# Altium schematic sheet Block_Diagram.SchDoc
size A3; SheetSize: A3; SheetNumber: 3; SheetTotal: 3
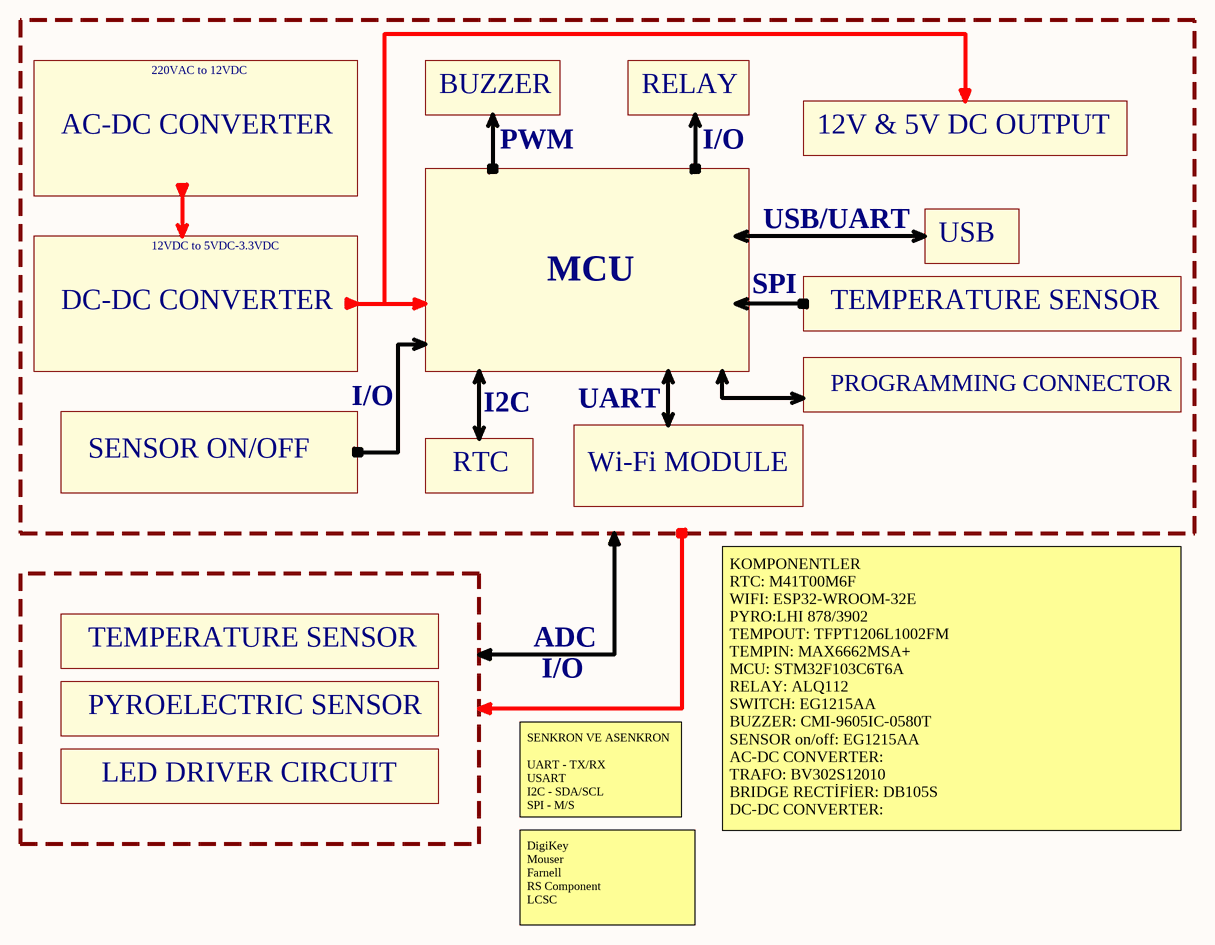
[diagram p0: Block_Diagram.SchDoc]

## Notes on the sheet
- 220VAC to 12VDC
- BUZZER
- RELAY
- AC-DC CONVERTER
- PWM
- I/O
- 12V & 5V DC OUTPUT
- 12VDC to 5VDC-3.3VDC
- USB/UART
- USB
- DC-DC CONVERTER
- MCU
- SPI
- TEMPERATURE SENSOR
- I2C
- UART
- PROGRAMMING CONNECTOR
- SENSOR ON/OFF
- RTC
- Wi-Fi MODULE
- ADC
- PYROELECTRIC SENSOR
- LED DRIVER CIRCUIT
- SENKRON VE ASENKRON
  UART - TX/RX
  USART
  I2C - SDA/SCL
  SPI - M/S
- KOMPONENTLER
  RTC: M41T00M6F
  WIFI: ESP32-WROOM-32E
  PYRO:LHI 878/3902
  TEMPOUT: TFPT1206L1002FM
  TEMPIN: MAX6662MSA+
  MCU: STM32F103C6T6A
  RELAY: ALQ112
  SWITCH: EG1215AA
  BUZZER: CMI-9605IC-0580T
  SENSOR on/off: EG1215AA
  AC-DC CONVERTER:
  TRAFO: BV302S12010
  BRIDGE RECTİFİER: DB105S
  DC-DC CONVERTER:
  5VDC: LM2675MX-12/NOPB
  3V3 LDO: AP7361-33E-13
  LED DRIVER MOSFET: SSM3K357R,LF
- DigiKey
  Mouser
  Farnell
  RS Component
  LCSC
- DOSYA ADI/FILE NAME
- HAZIRLAYAN / PREPARED BY
- YAYIN TARİHİ / REL. DATE
- KONTROL EDEN / CHECKED BY
- ONAYLAYAN / APPROVED BY
- BÖLÜM / DEPARTMENT
- DEĞ. TARİHİ / CHANGED TIME
- REVİZYON / REVISION
- BOYUT / SIZE
- SAYFA / SHEET